# EasyEDA schematic SCH_My-C51_2025-06-27.json
TITLE: AT89C51; REV: 1.0; Date: 2024-12-09; Sheet: 1/1; Drawn By: lzx15899541794; Company: WUT
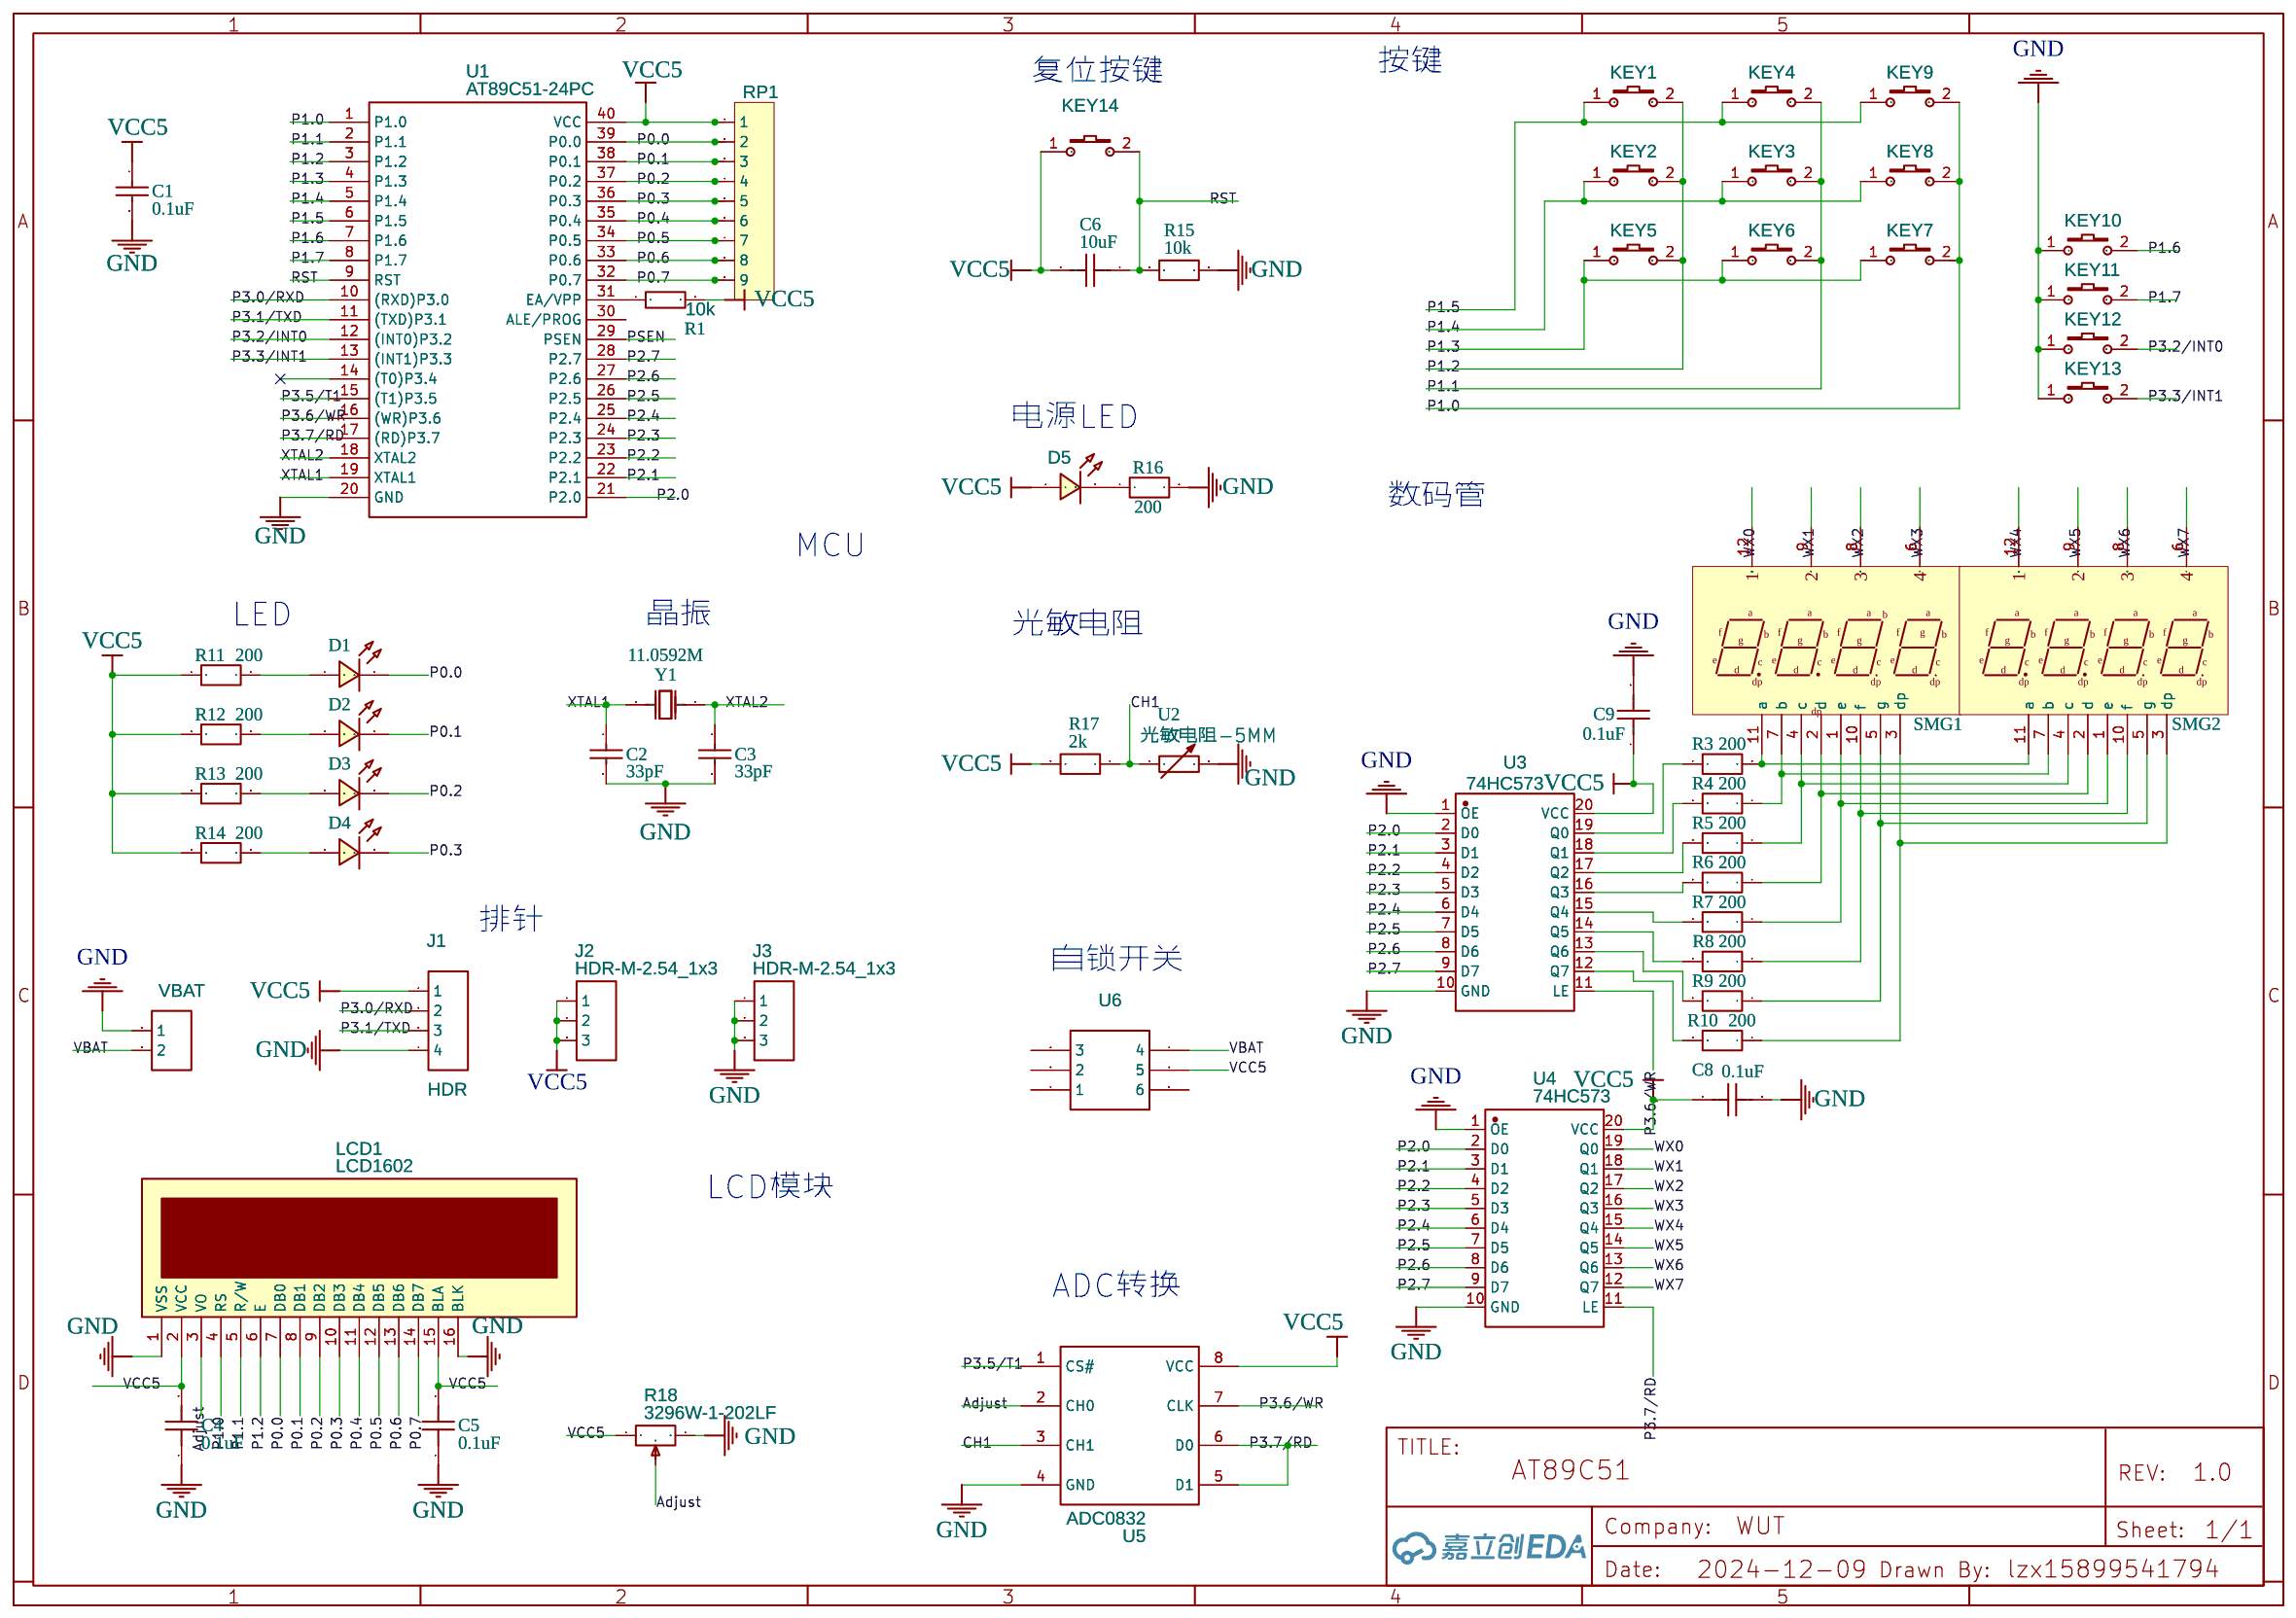
[diagram p0: schematic sheet]

## Parts
C1  0.1uF  [C0603]
C2  33pF  [C0603]
C3  33pF  [C0603]
C4  0.1uF  [C0603]
C5  0.1uF  [C0603]
C6  10uF  [C0603]
C8  0.1uF  [C0603]
C9  0.1uF  [C0603]
D1  LED-0603_R  [LED0603_RED]
D2  LED-0603_R  [LED0603_RED]
D3  LED-0603_R  [LED0603_RED]
D4  LED-0603_R  [LED0603_RED]
D5  LED-0603_R  [LED0603_RED]
J1  HDR  [HDR-M-2.54_1X4]
J2  HDR-M-2.54_1x3  [HDR-M-2.54_1X3]
J3  HDR-M-2.54_1x3  [HDR-M-2.54_1X3]
KEY1  K2-3.6×6.1_SMD  [KEY-SMD_2P-L6.2-W3.6-LS8.0]
KEY2  K2-3.6×6.1_SMD  [KEY-SMD_2P-L6.2-W3.6-LS8.0]
KEY3  K2-3.6×6.1_SMD  [KEY-SMD_2P-L6.2-W3.6-LS8.0]
KEY4  K2-3.6×6.1_SMD  [KEY-SMD_2P-L6.2-W3.6-LS8.0]
KEY5  K2-3.6×6.1_SMD  [KEY-SMD_2P-L6.2-W3.6-LS8.0]
KEY6  K2-3.6×6.1_SMD  [KEY-SMD_2P-L6.2-W3.6-LS8.0]
KEY7  K2-3.6×6.1_SMD  [KEY-SMD_2P-L6.2-W3.6-LS8.0]
KEY8  K2-3.6×6.1_SMD  [KEY-SMD_2P-L6.2-W3.6-LS8.0]
KEY9  K2-3.6×6.1_SMD  [KEY-SMD_2P-L6.2-W3.6-LS8.0]
KEY10  K2-3.6×6.1_SMD  [KEY-SMD_2P-L6.2-W3.6-LS8.0]
KEY11  K2-3.6×6.1_SMD  [KEY-SMD_2P-L6.2-W3.6-LS8.0]
KEY12  K2-3.6×6.1_SMD  [KEY-SMD_2P-L6.2-W3.6-LS8.0]
KEY13  K2-3.6×6.1_SMD  [KEY-SMD_2P-L6.2-W3.6-LS8.0]
KEY14  K2-3.6×6.1_SMD  [KEY-SMD_2P-L6.2-W3.6-LS8.0]
LCD1  LCD1602  [LCD1602]
P11  SMG2  [0.36-4位数码管]
P12  SMG1  [0.36-4位数码管]
R1  10k  [R0603]
R3  200  [R0603]
R4  200  [R0603]
R5  200  [R0603]
R6  200  [R0603]
R7  200  [R0603]
R8  200  [R0603]
R9  200  [R0603]
R10  200  [R0603]
R11  200  [R0603]
R12  200  [R0603]
R13  200  [R0603]
R14  200  [R0603]
R15  10k  [R0603]
R16  200  [R0603]
R17  2k  [R0603]
R18  3296W-1-202LF  [RES-ADJ_3296W]
RP1  排阻  [排阻]
U1  AT89C51-24PC  [AT89C51-24PC]
U2  光敏电阻-5MM  [RES-TH_L4.9-W4.3-P3.4]
U3  74HC573  [74HC573]
U4  74HC573  [74HC573]
U5  ADC0832  [ADC0832]
U6  自锁开关7*7  [自锁开关7*7]
VBAT  端子  [CONN-TH_2P-P5.00]
Y1  11.0592M  [HC-49US_L11.5-W4.5-P4.88]

## Library data of the parts
C1 = C0201X6S104K6R3NTA: Contributor: LCSC; Supplier: LCSC; Supplier Part: C357757; Manufacturer: EYANG(宇阳科技); JLCPCB Part Class: Extended Part
C2 C3 = CGA2B2C0G1H330JT0Y0F: Contributor: LCSC; Supplier: LCSC; Supplier Part: C342945; Manufacturer: TDK; JLCPCB Part Class: Extended Part
C4-C6 C8 C9 = C_0603_US: Contributor: LCEDA_Lib
D1-D5 = LED-0603_R: Manufacturer: EVERLIGHT(台湾亿光); Manufacturer Part: 19-217/R6C-AL1M2VY/3T; Supplier Part: C72044; Supplier: LCSC; Contributor: LCEDA_01
J1 = HDR-M-2.54_1x4: Supplier Part: C124378; Supplier: LCSC; Contributor: LCEDA_Lib
J2 J3 = HDR-M-2.54_1x3: Supplier Part: C180248; Supplier: LCSC; Contributor: LCEDA_Lib
KEY1-KEY14 = K2-3.6×6.1_SMD: Supplier Part: C118141; Supplier: LCSC; Manufacturer Part: K2-1107ST-A4SW-06; Contributor: LCEDA_Lib; 制造商: 韩国韩荣
LCD1 = LCD1602: Manufacturer: LONTECH(厦门龙特); Manufacturer Part: LCM1602K-NSW-BBW; Supplier Part: C83275; Supplier: LCSC; Contributor: LCEDA_Lib
P11 P12 = 0.36-4位数码管: Contributor: fzy15927630116; Supplier: 无
R1 = RK73H1JTTD1052F: Contributor: LCSC; Supplier: LCSC; Supplier Part: C317147; Manufacturer: KOA; JLCPCB Part Class: Extended Part
R3-R17 = R_0603_EU: Contributor: LCEDA_Lib
R18 = 3296W-1-202LF_C118206 copy: Supplier Part: C118206; Supplier: LCSC; Manufacturer: Bochen
RP1 = 排阻: Contributor: Lemoon
U1 = AT89C51-24PC: Contributor: fjq1234
U2 = 光敏电阻-5MM: Contributor: LCSC; Supplier: LCSC; Supplier Part: C9900003115; Manufacturer: null; JLCPCB Part Class: Extended Part
U3 U4 = 74HC573: Supplier: LCSC; Supplier Part: C233618; Manufacturer: onsemi(安森美); Manufacturer Part: MC74HC573ADWR2G; Contributor: manchip; JLCPCB Part Class: Extended Part
U5 = ADC0832: Contributor: q1239256226
U6 = 自锁开关7*7: Supplier: 无; Contributor: bazingahh
VBAT = CONN-TH_2P-P5.00: Supplier: LCSC; Contributor: south0829
Y1 = 晶振: Contributor: aklin

## Nets
GND: C1.2 C2.2 C3.2 C4.1 C5.1 C8.2 C9.2 J1.4 J3.1 J3.2 J3.3 KEY10.1 KEY11.1 KEY12.1 KEY13.1 LCD1.1(VSS) LCD1.16(BLK) R15.1 R16.2 R18.3 U1.20(GND) U2.2 U3.1(OE) U3.10(GND) U4.1(OE) U4.10(GND) U5.4(GND) VBAT.1
VBAT: U6.4 VBAT.2
VCC5: C1.1 C4.2 C5.2 C6.2 C8.1 C9.1 D5.1 J1.1 J2.1 J2.2 J2.3 KEY14.1 LCD1.2(VCC) LCD1.15(BLA) R1.2 R11.1 R12.1 R13.1 R14.1 R17.2 R18.1 RP1.1 U1.40(VCC) U3.20(VCC) U4.20(VCC) U5.8(VCC) U6.5
Adjust: LCD1.3(VO) R18.2 U5.2(CH0)
CH1: R17.1 U2.1 U5.3(CH1)
P0.0: D1.2 LCD1.7(DB0) RP1.2 U1.39(P0.0)
P0.1: D2.2 LCD1.8(DB1) RP1.3 U1.38(P0.1)
P0.2: D3.2 LCD1.9(DB2) RP1.4 U1.37(P0.2)
P0.3: D4.2 LCD1.10(DB3) RP1.5 U1.36(P0.3)
P0.4: LCD1.11(DB4) RP1.6 U1.35(P0.4)
P0.5: LCD1.12(DB5) RP1.7 U1.34(P0.5)
P0.6: LCD1.13(DB6) RP1.8 U1.33(P0.6)
P0.7: LCD1.14(DB7) RP1.9 U1.32(P0.7)
P1.0: KEY7.2 KEY8.2 KEY9.2 LCD1.4(RS) U1.1(P1.0)
P1.1: KEY3.2 KEY4.2 KEY6.2 LCD1.5(R/W) U1.2(P1.1)
P1.2: KEY1.2 KEY2.2 KEY5.2 LCD1.6(E) U1.3(P1.2)
P1.3: KEY5.1 KEY6.1 KEY7.1 U1.4(P1.3)
P1.4: KEY2.1 KEY3.1 KEY8.1 U1.5(P1.4)
P1.5: KEY1.1 KEY4.1 KEY9.1 U1.6(P1.5)
P1.6: KEY10.2 U1.7(P1.6)
P1.7: KEY11.2 U1.8(P1.7)
P2.0: U1.21(P2.0) U3.2(D0) U4.2(D0)
P2.1: U1.22(P2.1) U3.3(D1) U4.3(D1)
P2.2: U1.23(P2.2) U3.4(D2) U4.4(D2)
P2.3: U1.24(P2.3) U3.5(D3) U4.5(D3)
P2.4: U1.25(P2.4) U3.6(D4) U4.6(D4)
P2.5: U1.26(P2.5) U3.7(D5) U4.7(D5)
P2.6: U1.27(P2.6) U3.8(D6) U4.8(D6)
P2.7: U1.28(P2.7) U3.9(D7) U4.9(D7)
P3.0/RXD: J1.2 U1.10((RXD)P3.0)
P3.1/TXD: J1.3 U1.11((TXD)P3.1)
P3.2/INT0: KEY12.2 U1.12((INT0)P3.2)
P3.3/INT1: KEY13.2 U1.13((INT1)P3.3)
P3.5/T1: U1.15((T1)P3.5) U5.1(CS#)
P3.6/WR: U1.16((WR)P3.6) U3.11(LE) U5.7(CLK)
P3.7/RD: U1.17((RD)P3.7) U4.11(LE) U5.5(D1) U5.6(D0)
PSEN: U1.29(PSEN)
RST: C6.1 KEY14.2 R15.2 U1.9(RST)
WX0: P12.12(com) U4.19(Q0)
WX1: P12.9(2) U4.18(Q1)
WX2: P12.8(3) U4.17(Q2)
WX3: P12.6(4) U4.16(Q3)
WX4: P11.12(com) U4.15(Q4)
WX5: P11.9(2) U4.14(Q5)
WX6: P11.8(3) U4.13(Q6)
WX7: P11.6(4) U4.12(Q7)
XTAL1: C2.1 U1.19(XTAL1) Y1.2(OSC2)
XTAL2: C3.1 U1.18(XTAL2) Y1.1(OSC1)
Net-(D1-1): D1.1 R11.2
Net-(D2-1): D2.1 R12.2
Net-(D3-1): D3.1 R13.2
Net-(D4-1): D4.1 R14.2
Net-(D5-2): D5.2 R16.1
Net-(P11-1): P11.1(e) P12.1(e) R7.1
Net-(P11-2): P11.2(d) P12.2(d) R6.1
Net-(P11-3): P11.3(dp) P12.3(dp) R10.1
Net-(P11-4): P11.4(c) P12.4(c) R5.1
Net-(P11-5): P11.5(g) P12.5(g) R9.1
Net-(P11-7): P11.7(b) P12.7(b) R4.1
Net-(P11-10): P11.10(f) P12.10(f) R8.1
Net-(P11-11): P11.11(a) P12.11(a) R3.2
Net-(R1-1): R1.1 U1.31(EA/VPP)
Net-(R3-1): R3.1 U3.19(Q0)
Net-(R4-2): R4.2 U3.18(Q1)
Net-(R5-2): R5.2 U3.17(Q2)
Net-(R6-2): R6.2 U3.16(Q3)
Net-(R7-2): R7.2 U3.15(Q4)
Net-(R8-2): R8.2 U3.14(Q5)
Net-(R9-2): R9.2 U3.13(Q6)
Net-(R10-2): R10.2 U3.12(Q7)

Not connected (* = marked no-connect by the designer): U1 14((T0)P3.4) 30(ALE/PROG); U6 1 2 3 6

## Notes on the sheet
- 复位按键
- 按键
- 电源LED
- 数码管
- MCU
- LED
- 晶振
- 光敏电阻
- 排针
- 自锁开关
- LCD模块
- ADC转换
